# Altium schematic sheet filtroFinal-TC.SchDoc
size Letter
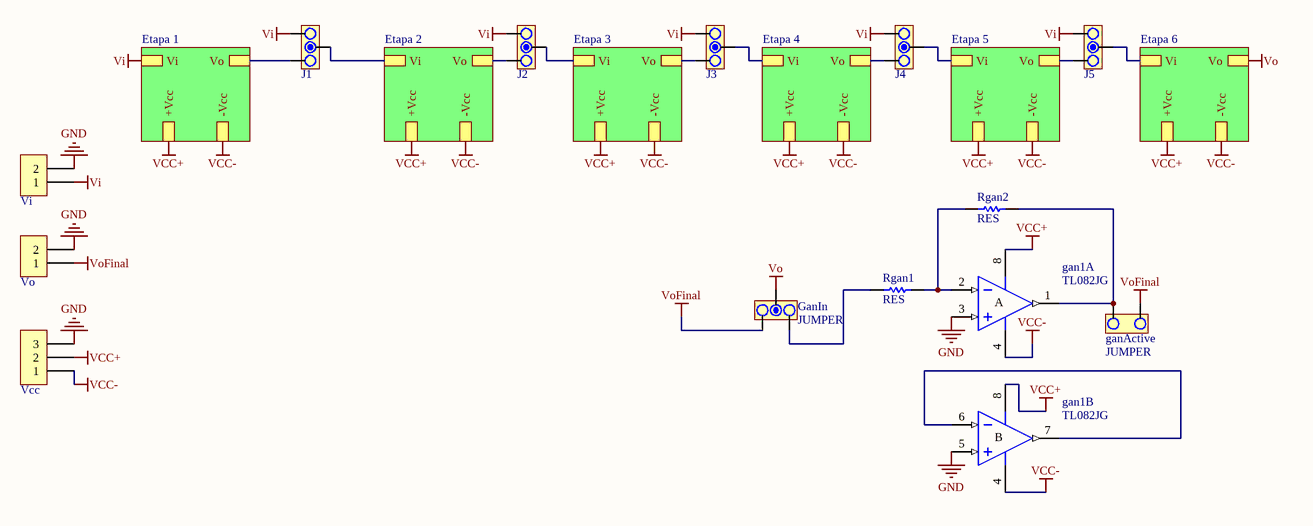
[diagram p0: filtroFinal-TC.SchDoc]

## Parts
gan1  TL082JG  [JG008]  (parts A,B of 2)
ganActive  JUMPER  [JUMPER2]
GanIn  JUMPER  [JUMPER3]
J1  JUMPER  [JUMPER3]  (value not drawn)
J2  JUMPER  [JUMPER3]  (value not drawn)
J3  JUMPER  [JUMPER3]  (value not drawn)
J4  JUMPER  [JUMPER3]  (value not drawn)
J5  JUMPER  [JUMPER3]  (value not drawn)
Rgan1  RES  [RES300]
Rgan2  RES  [RES300]
Vcc  BORNERA 3  [BORNERA3]  (value not drawn)
Vi  BORNERA 2  [BORNERA2]  (value not drawn)
Vo  BORNERA 2  [BORNERA2]  (value not drawn)

## Sub-sheets
Etapa 1 = etapa1.SchDoc: -Vcc, +Vcc, Vi, Vo
Etapa 2 = etapa2.SchDoc: -Vcc, +Vcc, Vi, Vo
Etapa 3 = etapa3.SchDoc: -Vcc, +Vcc, Vi, Vo
Etapa 4 = etapa4.SchDoc: -Vcc, +Vcc, Vi, Vo
Etapa 5 = etapa5.SchDoc: -Vcc, +Vcc, Vi, Vo
Etapa 6 = etapa6.SchDoc: -Vcc, +Vcc, Vi, Vo

## Nets
GND: gan1.3(IN+) gan1.5(IN+) Vcc.3 Vi.2 Vo.2
VCC+: gan1.8(V+) Vcc.2 ; sheet Etapa 1/+Vcc, sheet Etapa 2/+Vcc, sheet Etapa 3/+Vcc, sheet Etapa 4/+Vcc, sheet Etapa 5/+Vcc, sheet Etapa 6/+Vcc
VCC-: gan1.4(V-) Vcc.1 ; sheet Etapa 1/-Vcc, sheet Etapa 2/-Vcc, sheet Etapa 3/-Vcc, sheet Etapa 4/-Vcc, sheet Etapa 5/-Vcc, sheet Etapa 6/-Vcc
Vi: J1.3 J2.3 J3.3 J4.3 J5.3 Vi.1 ; sheet Etapa 1/Vi
Vo: GanIn.2 ; sheet Etapa 6/Vo
VoFinal: ganActive.2 GanIn.3 Vo.1
Netgan1_1: gan1.1(OUT) ganActive.1 Rgan2.2
Netgan1_2: gan1.2(IN-) Rgan1.2 Rgan2.1
Netgan1_6: gan1.6(IN-) gan1.7(OUT)
NetGanIn_1: GanIn.1 Rgan1.1
NetJ1_1: J1.1 ; sheet Etapa 1/Vo
NetJ1_2: J1.2 ; sheet Etapa 2/Vi
NetJ2_1: J2.1 ; sheet Etapa 2/Vo
NetJ2_2: J2.2 ; sheet Etapa 3/Vi
NetJ3_1: J3.1 ; sheet Etapa 3/Vo
NetJ3_2: J3.2 ; sheet Etapa 4/Vi
NetJ4_1: J4.1 ; sheet Etapa 4/Vo
NetJ4_2: J4.2 ; sheet Etapa 5/Vi
NetJ5_1: J5.1 ; sheet Etapa 5/Vo
NetJ5_2: J5.2 ; sheet Etapa 6/Vi

## Notes on the sheet
- (in symbol TL082JG, part A) A
- (in symbol TL082JG, part B) B

## Library data of the parts
gan1 = TL082JG: JFET-Input Operational Amplifier; Published: 16-Jan-2001; LatestRevisionDate: 04-Mar-2005; LatestRevisionNote: Stylized 3D Model Added.; DatasheetVersion: Feb-1999; PackageVersion: Jan-1995; PackageReference: JG008; Publisher: Altium Limited; PackageDescription: DIP; 8 Leads; Row Spacing 7.62 mm; Pitch 2.54 mm; ComponentLink1Description: Manufacturer Link; ComponentLink1URL: http://www.ti.com/; ComponentLink2Description: Datasheet; ComponentLink2URL: http://www-s.ti.com/sc/ds/tl082.pdf
GanIn J1-J5 = JUMPER3